# Altium schematic sheet TemperatureACQ.SchDoc: TemperatureACQ
size A4; Author: João Guimarães; Organization: Altium Limited; Address1: L3, 12a Rodborough Rd; Address2: Frenchs Forest; Address3: NSW; Address4: Australia 2086; Revision: 2.0; SheetNumber: 7; SheetTotal: 9
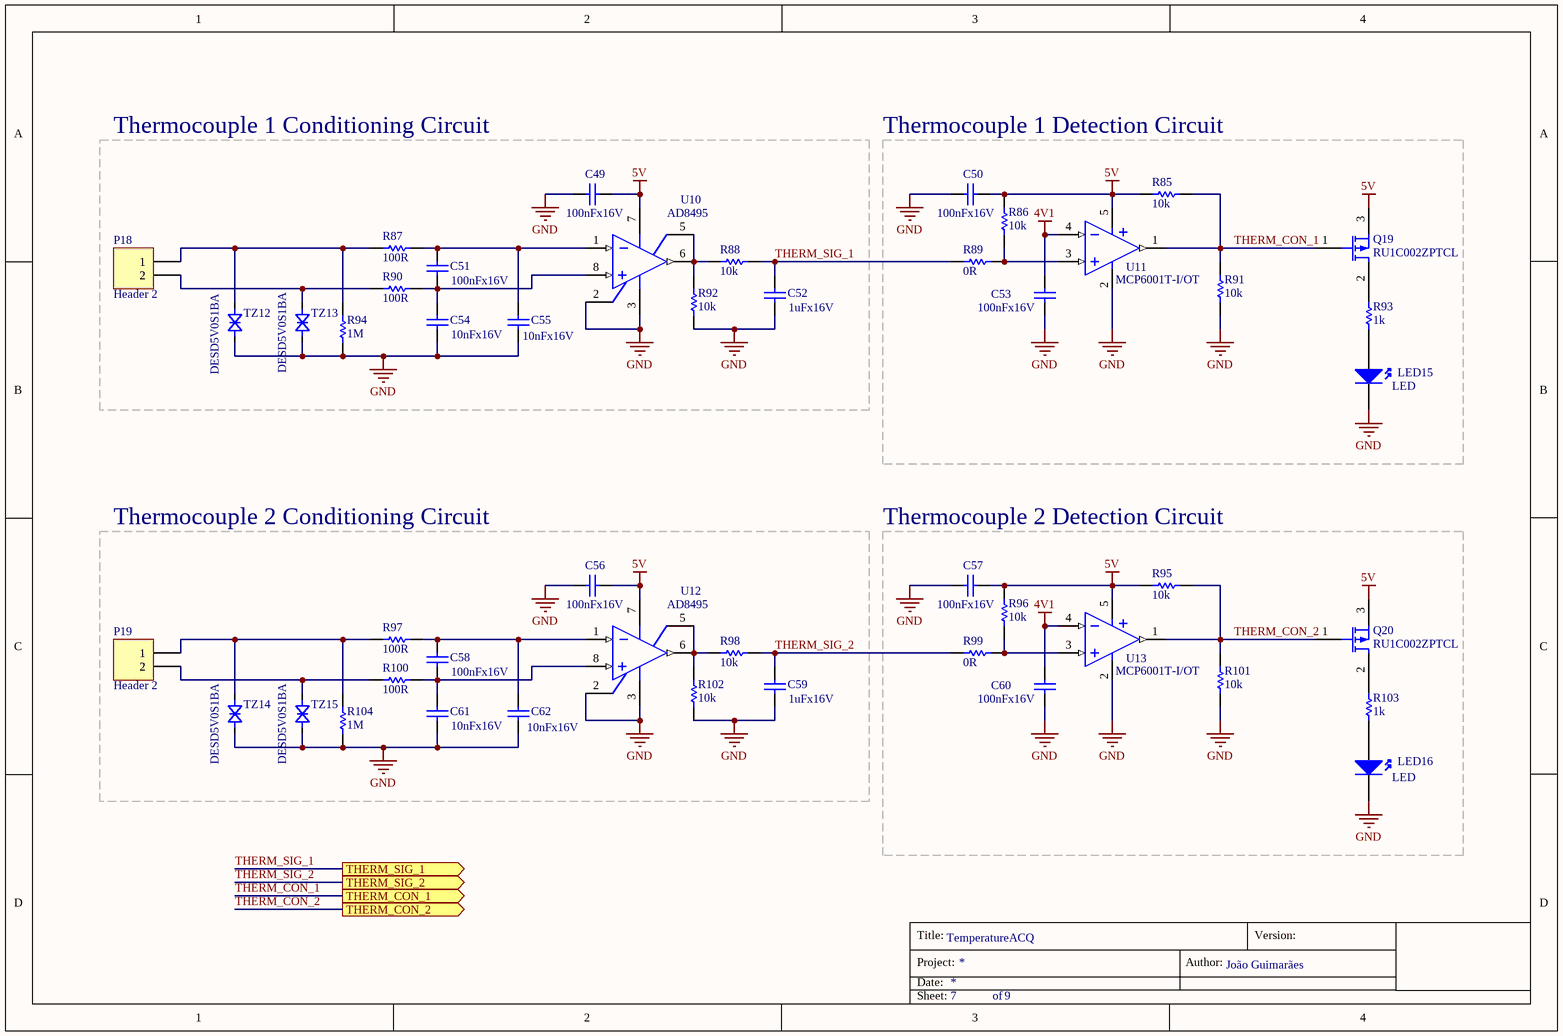
[diagram p0: TemperatureACQ.SchDoc]

## Parts
C49  100nFx16V  [DISC-0805]
C50  100nFx16V  [DISC-0805]
C51  100nFx16V  [DISC-0805]
C52  1uFx16V  [DISC-0805]
C53  100nFx16V  [DISC-0805]
C54  10nFx16V  [DISC-0805]
C55  10nFx16V  [DISC-0805]
C56  100nFx16V  [DISC-0805]
C57  100nFx16V  [DISC-0805]
C58  100nFx16V  [DISC-0805]
C59  1uFx16V  [DISC-0805]
C60  100nFx16V  [DISC-0805]
C61  10nFx16V  [DISC-0805]
C62  10nFx16V  [DISC-0805]
LED15  LED  [DISC-LED-0.1-PTH]
LED16  LED  [DISC-LED-0.1-PTH]
P18  Header 2  [CON-FLEXWIRE-0.5MM2-1X2]
P19  Header 2  [CON-FLEXWIRE-0.5MM2-1X2]
Q19  RU1C002ZPTCL  [DISC-SOT-23]
Q20  RU1C002ZPTCL  [DISC-SOT-23]
R85  10k  [DISC-0805]
R86  10k  [DISC-0805]
R87  100R  [DISC-0805]
R88  10k  [DISC-0805]
R89  0R  [DISC-0805]
R90  100R  [DISC-0805]
R91  10k  [DISC-0805]
R92  10k  [DISC-0805]
R93  1k  [DISC-0805]
R94  1M  [DISC-0805]
R95  10k  [DISC-0805]
R96  10k  [DISC-0805]
R97  100R  [DISC-0805]
R98  10k  [DISC-0805]
R99  0R  [DISC-0805]
R100  100R  [DISC-0805]
R101  10k  [DISC-0805]
R102  10k  [DISC-0805]
R103  1k  [DISC-0805]
R104  1M  [DISC-0805]
TZ12  DESD5V0S1BA  [DISC-SOD-323]
TZ13  DESD5V0S1BA  [DISC-SOD-323]
TZ14  DESD5V0S1BA  [DISC-SOD-323]
TZ15  DESD5V0S1BA  [DISC-SOD-323]
U10  AD8495  [CI-MSOP-8]
U11  MCP6001T-I/OT  [CI-SOT-23-5]
U12  AD8495  [CI-MSOP-8]
U13  MCP6001T-I/OT  [CI-SOT-23-5]

## Blocks framed on the sheet
Thermocouple 1 Conditioning Circuit: C49 C51 C52 C54 C55 P18 R87 R88 R90 R92 R94 TZ12 TZ13 U10
Thermocouple 1 Detection Circuit: C50 C53 LED15 Q19 R85 R86 R89 R91 R93 U11
Thermocouple 2 Conditioning Circuit: C56 C58 C59 C61 C62 P19 R97 R98 R100 R102 R104 TZ14 TZ15 U12
Thermocouple 2 Detection Circuit: C57 C60 LED16 Q20 R95 R96 R99 R101 R103 U13

## Ports
THERM_CON_1 (out), THERM_CON_2 (out), THERM_SIG_1 (out), THERM_SIG_2 (out)

## Nets
4V1: C53.2 C60.2 U11.4(IN-) U13.4(IN-)
5V: C49.1 C50.2 C56.1 C57.2 Q19.3(S) Q20.3(S) R85.1 R86.1 R95.1 R96.1 U10.7(V+) U11.5(V+) U12.7(V+) U13.5(V+)
GND: C49.2 C50.1 C52.1 C53.1 C54.1 C55.1 C56.2 C57.1 C59.1 C60.1 C61.1 C62.1 LED15.2(K) LED16.2(K) R91.2 R92.2 R94.1 R101.2 R102.2 R104.1 TZ12.1(A) TZ13.1(A) TZ14.1(A) TZ15.1(A) U10.2(REF) U10.3(V-) U11.2(V-) U12.2(REF) U12.3(V-) U13.2(V-)
THERM_CON_1: Q19.1(G) R85.2 R91.1 U11.1(Out) ; port THERM_CON_1
THERM_CON_2: Q20.1(G) R95.2 R101.1 U13.1(Out) ; port THERM_CON_2
THERM_SIG_1: C52.2 R88.2 R89.1 ; port THERM_SIG_1
THERM_SIG_2: C59.2 R98.2 R99.1 ; port THERM_SIG_2
NetC51_1: C51.1 C54.2 R90.1 U10.8(IN+)
NetC51_2: C51.2 C55.2 R87.1 U10.1(IN-)
NetC58_1: C58.1 C61.2 R100.1 U12.8(IN+)
NetC58_2: C58.2 C62.2 R97.1 U12.1(IN-)
NetLED15_1: LED15.1(A) R93.1
NetLED16_1: LED16.1(A) R103.1
NetP18_1: P18.1 R87.2 R94.2 TZ12.2(K)
NetP18_2: P18.2 R90.2 TZ13.2(K)
NetP19_1: P19.1 R97.2 R104.2 TZ14.2(K)
NetP19_2: P19.2 R100.2 TZ15.2(K)
NetQ19_2: Q19.2(D) R93.2
NetQ20_2: Q20.2(D) R103.2
NetR86_2: R86.2 R89.2 U11.3(IN+)
NetR88_1: R88.1 R92.1 U10.5(SENSE) U10.6(OUT)
NetR96_2: R96.2 R99.2 U13.3(IN+)
NetR98_1: R98.1 R102.1 U12.5(SENSE) U12.6(OUT)

## Notes on the sheet
- Title:
- Project:
- Date:
- Author:
- Version:
- Sheet:
- of

## Library data of the parts
C49-C62 = Cap: Capacitor
P18 P19 = Header 2: Header, 2-Pin; LatestRevisionDate: 17-Jul-2002; LatestRevisionNote: Re-released for DXP Platform.; Publisher: Altium Limited
Q19 Q20 = Transistor-PMOS: P-Channel MOSFET
R85-R104 = Res: Resistor
TZ12-TZ15 = TVZ-Bi-Directional
U10 U12 = AD8495: Precision Type K Thermocouple Amplifier with Cold Junction Compensation
U11 U13 = MCP6001T-I/OT: Operational Amplifiers - Op Amps Single 1.8V 1MHz